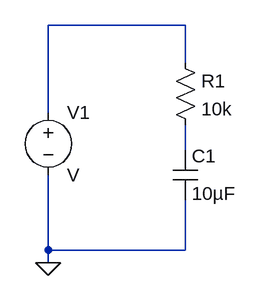
[diagram p0: schematic Draft3.asc]
Draft3.asc, the LTspice schematic file:
Version 4
SHEET 1 880 680
WIRE 224 16 48 16
WIRE 224 64 224 16
WIRE 48 128 48 16
WIRE 224 176 224 144
WIRE 48 304 48 208
WIRE 224 304 224 240
WIRE 224 304 48 304
WIRE 48 320 48 304
FLAG 48 320 0
SYMBOL cap 208 176 R0
SYMATTR InstName C1
SYMATTR Value 10µF
SYMBOL res 208 48 R0
SYMATTR InstName R1
SYMATTR Value 10k
SYMBOL voltage 48 112 R0
SYMATTR InstName V1

The netlist it stands for:
* Draft3.asc
C1 N002 0 10µF
R1 N001 N002 10k
V1 N001 0 V
.backanno
.end